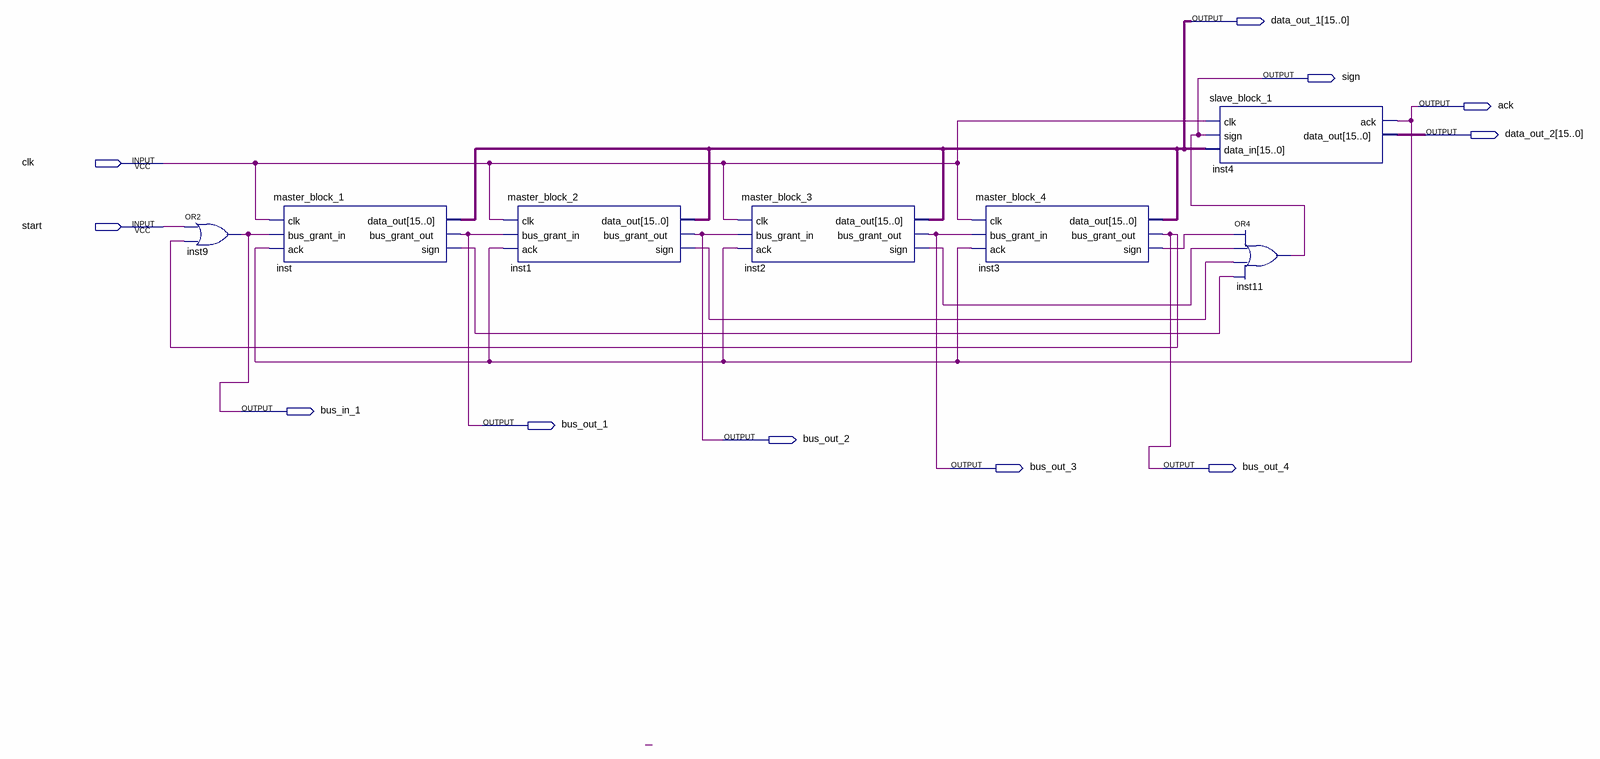
[diagram p0: schematic sheet]
// Quartus schematic laba7_var1.bdf as structural Verilog: 7 symbols, 11 pins
module laba7_var1 (
  input  clk,
  input  start,
  output [15:0] data_out_1,
  output sign,
  output ack,
  output [15:0] data_out_2,
  output bus_in_1,
  output bus_out_1,
  output bus_out_2,
  output bus_out_3,
  output bus_out_4
);

  wire inst1_sign, inst2_sign, inst3_sign, inst_sign;

  or inst9 (bus_in_1, start, bus_out_4);
  master_block_1 inst (
    .clk(clk), .bus_grant_in(bus_in_1), .ack(ack), .data_out(data_out_1), .bus_grant_out(bus_out_1),
    .sign(inst_sign));
  master_block_2 inst1 (
    .clk(clk), .bus_grant_in(bus_out_1), .ack(ack), .data_out(data_out_1), .bus_grant_out(bus_out_2),
    .sign(inst1_sign));
  master_block_3 inst2 (
    .clk(clk), .bus_grant_in(bus_out_2), .ack(ack), .data_out(data_out_1), .bus_grant_out(bus_out_3),
    .sign(inst2_sign));
  master_block_4 inst3 (
    .clk(clk), .bus_grant_in(bus_out_3), .ack(ack), .data_out(data_out_1), .bus_grant_out(bus_out_4),
    .sign(inst3_sign));
  slave_block_1 inst4 (.clk(clk), .sign(sign), .data_in(data_out_1), .ack(ack), .data_out(data_out_2));
  or inst11 (sign, inst3_sign, inst2_sign, inst1_sign, inst_sign);
endmodule
